# EAGLE design pcf8574_lcd_hw1.0 (EAGLE 6.5.0)
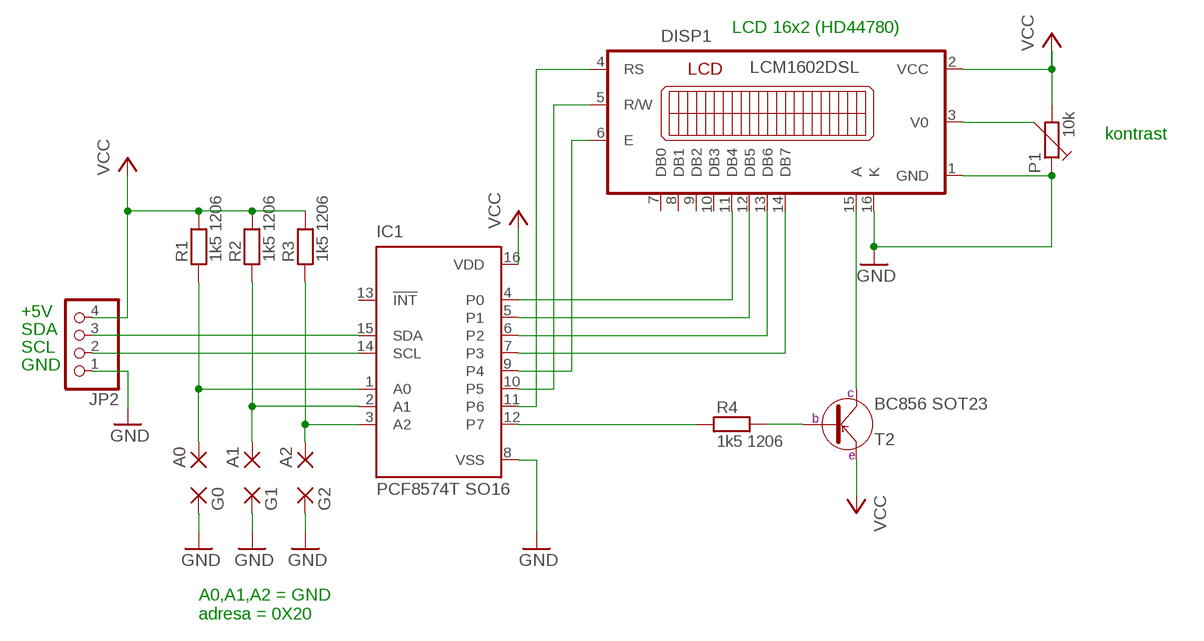
[diagram p0: schematic, sheet 1]

## Parts
A0  SMD2  [SMD1,27-2,54]
A1  SMD2  [SMD1,27-2,54]
A2  SMD2  [SMD1,27-2,54]
DISP1  LCM1602DSL  [LCM1602DSL]
G0  SMD2  [SMD1,27-2,54]
G1  SMD2  [SMD1,27-2,54]
G2  SMD2  [SMD1,27-2,54]
IC1  PCF8574T SO16  PCF8574T  [SO16W]
JP2  PINHD-1X4  [1X04]
P1  10k  TRIMRPT10V  [PT10V]
R1  1k5 1206  R_1206  [1206]
R2  1k5 1206  R_1206  [1206]
R3  1k5 1206  R_1206  [1206]
R4  1k5 1206  R_1206  [1206]
T2  BC856 SOT23  BC856  [SOT-23]

## Nets
GND: DISP1.1(GND) DISP1.16(K) G0.1(P) G1.1(P) G2.1(P) IC1.8(VSS) JP2.1 P1.1
N$1: IC1.15(SDA) JP2.3
N$2: IC1.14(SCL) JP2.2
N$3: DISP1.3(V0) P1.3
N$5: DISP1.15(A) T2.3(C)
N$6: DISP1.4(RS) IC1.11(P6)
N$7: DISP1.5(R/W) IC1.10(P5)
N$8: DISP1.6(E) IC1.9(P4)
N$9: DISP1.14(DB7) IC1.7(P3)
N$10: IC1.12(P7) R4.1
N$11: A0.1(P) IC1.1(A0) R1.1
N$12: A2.1(P) IC1.3(A2) R3.1
N$13: A1.1(P) IC1.2(A1) R2.1
N$14: DISP1.13(DB6) IC1.6(P2)
N$15: DISP1.12(DB5) IC1.5(P1)
N$16: DISP1.11(DB4) IC1.4(P0)
N$17: R4.2 T2.1(B)
VCC: DISP1.2(VCC) IC1.16(VDD) JP2.4 P1.2 R1.2 R2.2 R3.2 T2.2(E)
Unconnected: DISP1.7(DB0) DISP1.8(DB1) DISP1.9(DB2) DISP1.10(DB3) IC1.13(!INT)

## Notes on the sheet
- LCD 16x2 (HD44780)
- kontrast
- +5V
- SDA
- SCL
- GND
- A0,A1,A2 = GND
  adresa = 0X20

## Library data of the parts
A0 A1 A2 G0 G1 G2 = wirepad:SMD2: SMD PAD
DISP1 = #PaJa_displeje:LCM1602DSL: LCD - 2x16 + LED (TME - LCM1602DSL)
IC1 = micro-philips:PCF8574: I2C-Bus Remote 8-bit I/O expander http://www.semiconductors.philips.com/acrobat_download/datasheets/PCF8574_4.pdf; MPN: PCF8574T/3,512; OC_FARNELL: 1201255; OC_NEWARK: 70R6870
JP2 = pinhead:PINHD-1X4: PIN HEADER
P1 = #PaJa_31:TRIMR: Trimr
R1-R4 = #PaJa_31:R: Rezistor
T2 = #PaJa_31:BC856: SMD tranzistor - PNP - ekv. BC556

## Board
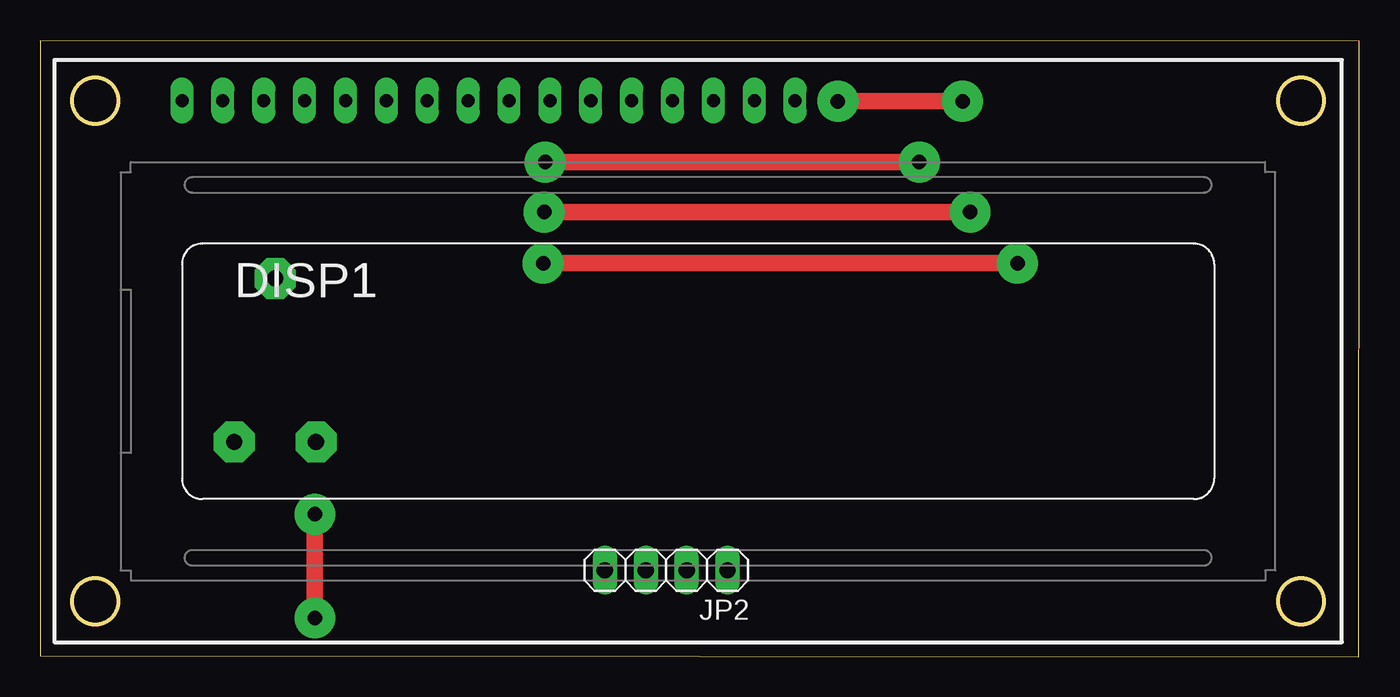
[diagram p1: board, top side]
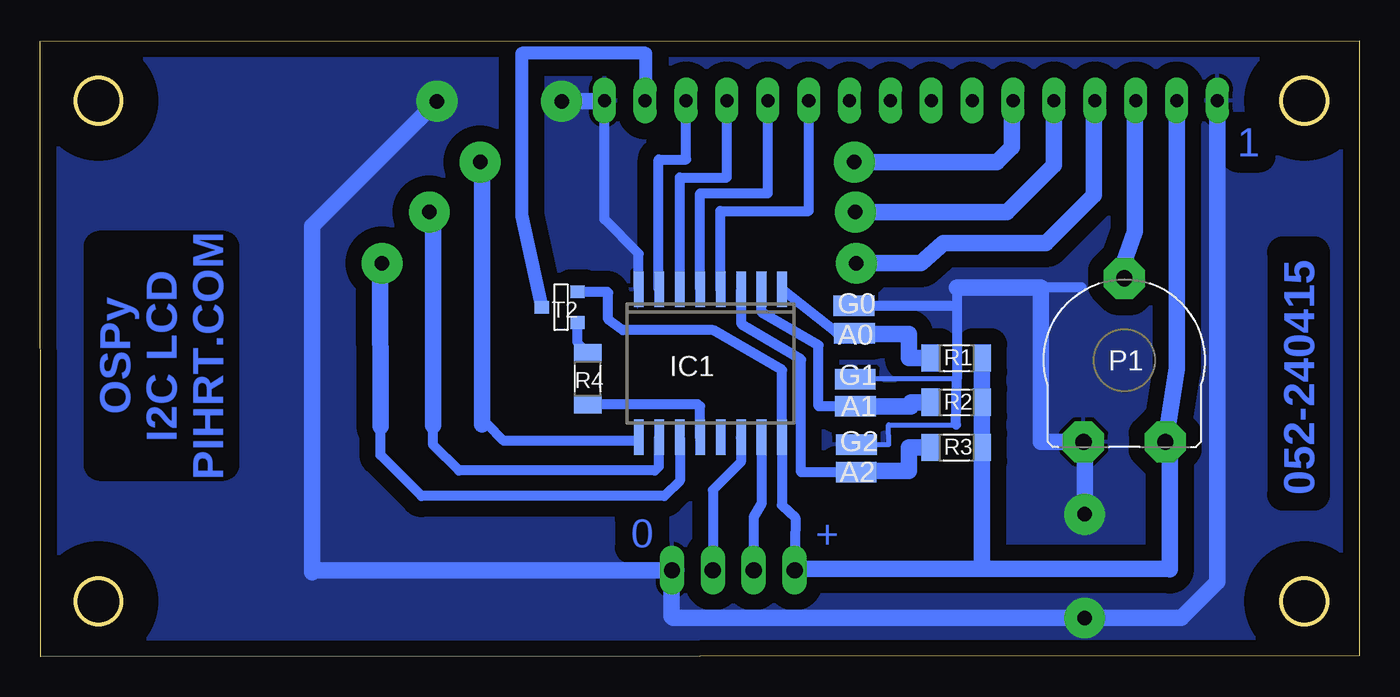
[diagram p2: board, bottom side, seen from below]

Size 81.96 x 38.29 mm. Coordinates in mm from the lower left corner, seen from the top.
Outline: 0.01,0.04 81.94,0 81.96,38.25 0,38.29 0.01,0.04
Copper layers (1*16): Top 0.035mm / dielectric 1.5mm / Bottom 0.035mm
Design rules "default *": minimum track width 10mil, minimum drill 24mil, track to track 8mil, track to pad 8mil, pad to pad 8mil, via to via 8mil, smd to smd 8mil, copper to edge 40mil, drill to drill 8mil, minimum pad ring 10mil, minimum via ring 20mil, stop-mask expansion 4mil, vias tented up to drill 0mil, thermal gap 10mil

### Footprints (pad centres in the part's own frame; a part is rotated, then mirrored left to right if it is on the bottom)
SMD1,27-2,54 = smd 1.27 x 2.54: 1 0,0
LCM1602DSL = drill 0.813 pad 1.422 long: 1 -32.068,16.828; 2 -29.527,16.828; 3 -26.988,16.828; 4 -24.448,16.828; 5 -21.907,16.828; 6 -19.367,16.828; 7 -16.828,16.828; 8 -14.287,16.828; 9 -11.748,16.828; 10 -9.207,16.828; 11 -6.668,16.828; 12 -4.128,16.828; 13 -1.587,16.828; 14 0.953,16.828; 15 3.493,16.828; 16 6.032,16.828 | hole 2.8: -37.465,-14.287; 37.465,-14.287; 37.465,16.828; -37.465,16.828
SO16W = smd 0.6 x 2.2: 1 -4.445,-4.6; 2 -3.175,-4.6; 3 -1.905,-4.6; 4 -0.635,-4.6; 5 0.635,-4.6; 6 1.905,-4.6; 7 3.175,-4.6; 8 4.445,-4.6; 9 4.445,4.6; 10 3.175,4.6; 11 1.905,4.6; 12 0.635,4.6; 13 -0.635,4.6; 14 -1.905,4.6; 15 -3.175,4.6; 16 -4.445,4.6
1X04 = drill 1.016 long: 1 -3.81,0; 2 -1.27,0; 3 1.27,0; 4 3.81,0
PT10V = drill 1.016 pad 2.54 octagon: 1 -2.54,-5.08; 2 2.54,-5.08; 3 0,5.08
1206 = smd 1.143 x 1.702: 1 -1.587,0; 2 1.587,0
SOT-23 = smd 0.787 x 0.889: 1 -0.953,-0.953; 2 0.953,-0.953; 3 0,1.27

### Placement (x,y rotation side)
A0  31.37,20.11 270 bottom
A1  31.31,15.55 270 bottom
A2  31.26,11.46 270 bottom
DISP1  40.88,17.73 0 top
G0  31.4,21.82 270 bottom
G1  31.32,17.25 270 bottom
G2  31.25,13.18 270 bottom
IC1  40.32,18.23 180 bottom
JP2  38.9,5.37 180 top
P1  14.59,18.43 0 bottom
R1  25.03,18.56 0 bottom
R2  25.03,15.81 0 bottom
R3  25.03,13 0 bottom
R4  47.94,17.28 90 bottom
T2  49.52,21.72 90 bottom

### Tracks (layer width: path | path; a pad name or v marks a point on that pad's centre or on a via)
GND  (via drill 0.9 pad 2.54)
  Top 1.016: v17.07,8.84 v17.07,2.4 | v49.56,34.52 v57.31,34.52
  Bottom 0.305: G2.1 29.24,13.18 29.25,14.41 25.06,14.41 | 25.01,17.25 G1.1 | G1.1 | IC1.8 44.72,22.83
  Bottom 0.61: 25.06,14.41 25.01,17.25 25,21.82 | G0.1 25,21.82 | 25,22.95 25,21.82 | 17.25,22.95 19.79,22.95 | IC1.8 44.78,22.84 44.78,25.05 46.91,27.18 DISP1.16
  Bottom 1.016: 25,22.95 19.79,22.95 19.79,13.35 P1.1 17.07,13.28 v17.07,8.84 | DISP1.1 8.81,4.66 11.06,2.4 v17.07,2.4 42.63,2.4 42.74,2.5 42.74,5.34 JP2.1 64.94,5.37 65.06,5.25 65.06,26.77 v57.31,34.52 | DISP1.16 46.95,34.52 v49.56,34.52
  pour Bottom (isolate 1, rank 6): 0.12,38.08 81.59,38.08 81.59,0.2 0.12,0.2 0.12,38.09 0.12,38.1
N$1
  Bottom 0.305: IC1.15
  Bottom 0.61: IC1.15 37.13,9.53 37.63,8.68 JP2.3
N$2
  Bottom 0.61: IC1.14 38.43,13.62 38.43,12.09 40.17,10.35 JP2.2
N$3
  Bottom 1.016: DISP1.3 13.93,34.56 13.93,26.43 14.64,24.49 P1.3
N$5
  Bottom 0.305: DISP1.15 44.33,34.56
  Bottom 0.813: 44.33,34.56 44.33,37.5 52.04,37.5 52.04,27.43 T2.3
N$6  (via drill 0.9 pad 2.54)
  Top 1.016: v31.25,24.45 v60.72,24.45
  Bottom 0.61: IC1.11 42.22,10.94 43.17,9.98 58.28,9.98 60.82,12.52 60.82,14.31
  Bottom 1.016: DISP1.4 16.49,34.5 16.49,28.7 19.47,25.72 25.85,25.72 27.23,24.45 v31.25,24.45 | v60.72,24.45 60.83,24.35 60.82,14.31
N$7  (via drill 0.9 pad 2.54)
  Top 1.016: v31.31,27.64 v57.78,27.64
  Bottom 0.61: IC1.10 43.53,13.59 43.53,11.8 43.77,11.56 55.94,11.56 57.53,13.15 57.53,14.37
  Bottom 1.016: DISP1.5 18.97,30.56 21.89,27.64 v31.31,27.64 | v57.78,27.64 57.53,27.39 57.53,14.37
N$8  (via drill 0.9 pad 2.54)
  Top 1.016: v31.37,30.75 v54.62,30.75
  Bottom 0.61: IC1.9 44.97,13.42 53.16,13.42 54.17,14.42 54.5,14.42
  Bottom 1.016: DISP1.6 21.57,34.5 21.57,31.68 22.5,30.75 v31.37,30.75 | v54.62,30.75 54.5,30.62 54.5,14.42
N$9
  Bottom 0.305: IC1.7 43.54,22.83
  Bottom 0.61: 43.54,22.83 43.54,30.89 41.83,30.89 DISP1.14
N$10
  Bottom 0.305: IC1.12 40.98,13.63 | 47.81,15.96 R4.1
  Bottom 0.61: 40.98,13.63 IC1.12 40.96,15.56 41.1,15.69 R4.1
N$11
  Bottom 0.305: A0.1 32.5,20.13
  Bottom 0.61: 32.5,20.13 IC1.1
  Bottom 1.016: R1.1 27.99,18.56 27.99,20.05 31.37,20.05 A0.1
N$12
  Bottom 0.61: A2.1 34.69,11.46 34.69,18.47 38.38,20.65 IC1.3
  Bottom 1.016: R3.1 27.99,13 27.99,11.53 31.26,11.53 A2.1
N$13
  Bottom 0.61: A1.1 33.6,15.55 33.6,19.35 37.14,21.4 IC1.2
  Bottom 1.016: R2.1 27.87,15.81 27.87,15.56 31.31,15.56 A1.1
N$14
  Bottom 0.305: IC1.6
  Bottom 0.61: IC1.6 42.21,29.78 39.29,29.78 DISP1.13
N$15
  Bottom 0.305: IC1.5
  Bottom 0.61: IC1.5 40.95,28.81 36.75,28.81 DISP1.12
N$16
  Bottom 0.305: IC1.4 39.7,22.83
  Bottom 0.61: 39.7,22.83 39.7,27.7 34.21,27.7 DISP1.11
N$17
  Bottom 0.61: R4.2 48.57,19.5 T2.1
VCC
  Bottom 0.305: 35.87,13.61 IC1.16 35.86,13.63 | 48.57,22.73 T2.2
  Bottom 0.61: 35.87,13.61 35.87,9.4 35.04,8.63 JP2.4 | 35.86,13.63 35.86,17.81 40.15,20.3 45.77,20.3 46.66,20.96 46.66,22.61 46.73,22.67 T2.2
  Bottom 1.016: R1.2 | R1.2 R2.2 | R2.2 | R2.2 R3.2 23.45,5.44 | DISP1.2 | DISP1.2 11.35,17.86 11.32,17.9 P1.2 11.78,13.08 11.78,5.43 11.79,5.44 23.45,5.44 | JP2.4 35.09,5.44 23.45,5.44
(copper drawn outside any net)
  shapes: Bottom circle x4

### Text on the board
Bottom: 1 | OSPy / I2C LCD / PIHRT.COM | 052-240415 | + | 0